# EAGLE design battleship (EAGLE 9.2.0)
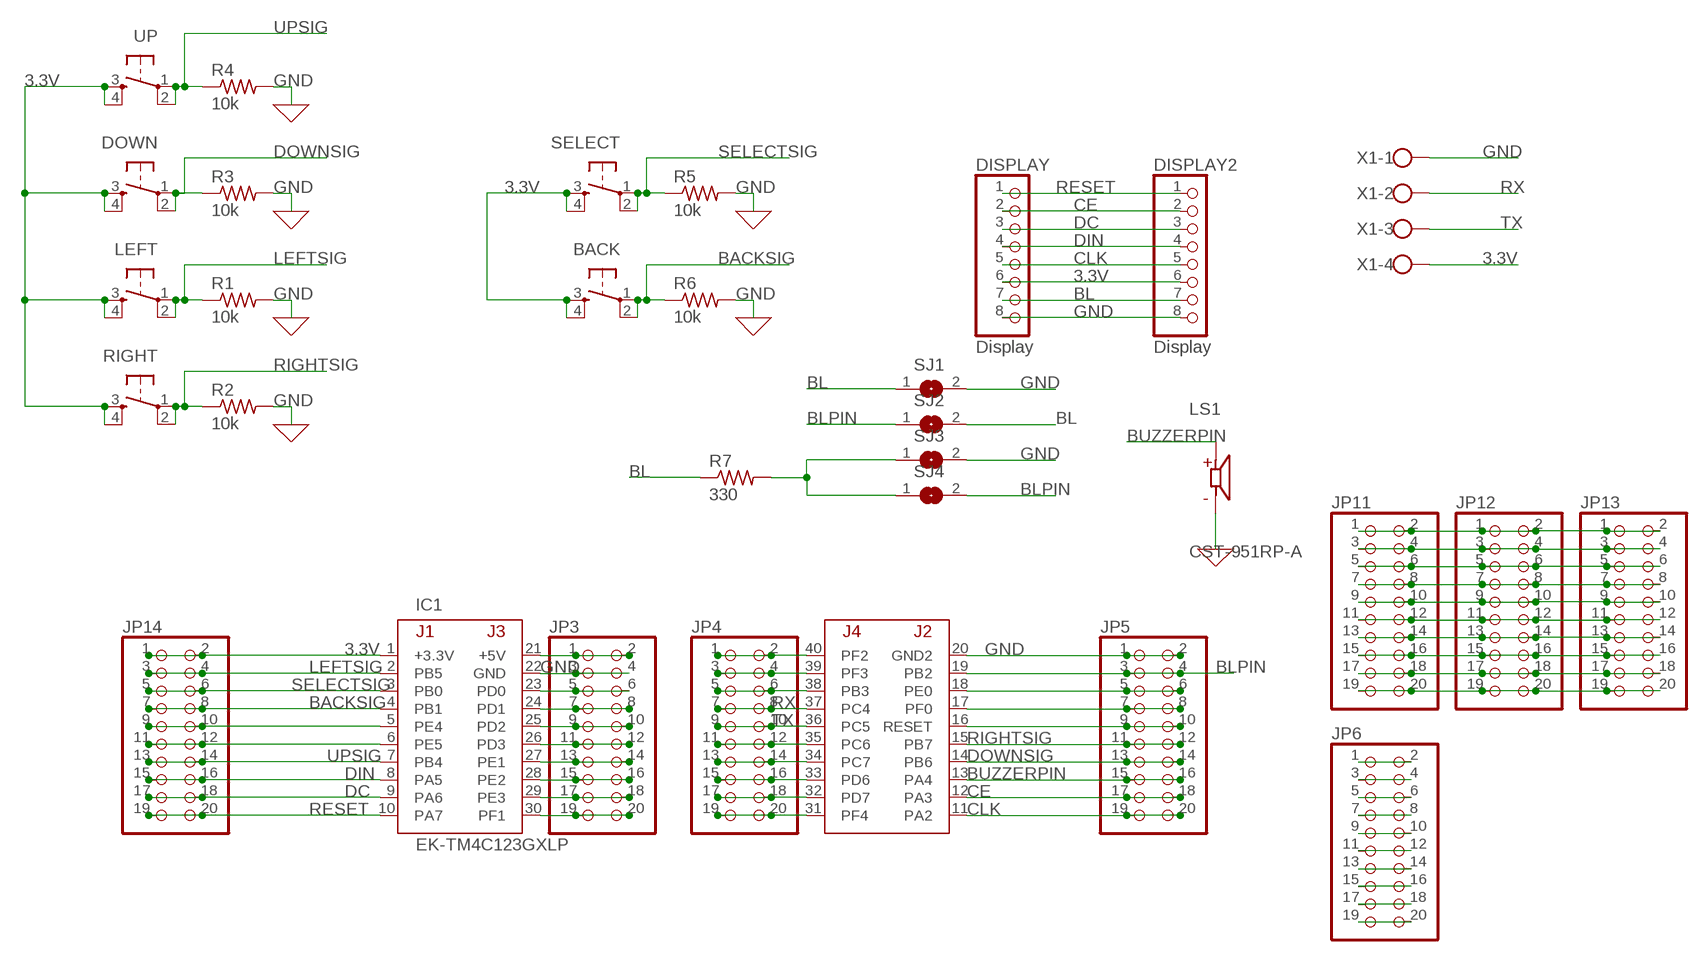
[diagram p0: schematic, sheet 1]

## Parts
BACK  TAC_SWITCHPTH  [TACTILE-PTH]
DISPLAY  Display  PINHD-1X8  [1X08]
DISPLAY2  Display  PINHD-1X8  [1X08]
DOWN  TAC_SWITCHPTH  [TACTILE-PTH]
IC1  EK-TM4C123GXLP  [TM4C123LAUNCHPAD]
JP3  PINHD-2X10  [2X10]
JP4  PINHD-2X10  [2X10]
JP5  PINHD-2X10  [2X10]
JP6  PINHD-2X10  [2X10]
JP11  PINHD-2X10  [2X10]
JP12  PINHD-2X10  [2X10]
JP13  PINHD-2X10  [2X10]
JP14  PINHD-2X10  [2X10]
LEFT  TAC_SWITCHPTH  [TACTILE-PTH]
LS1  CST-951RP-A  [CUI_CST-951RP-A]
R1  10k  R-US_0207/10  [0207/10]
R2  10k  R-US_0207/10  [0207/10]
R3  10k  R-US_0207/10  [0207/10]
R4  10k  R-US_0207/10  [0207/10]
R5  10k  R-US_0207/10  [0207/10]
R6  10k  R-US_0207/10  [0207/10]
R7  330  R-US_0207/10  [0207/10]
RIGHT  TAC_SWITCHPTH  [TACTILE-PTH]
SELECT  TAC_SWITCHPTH  [TACTILE-PTH]
SJ1  SJ  [SJ]
SJ2  SJ  [SJ]
SJ3  SJ  [SJ]
SJ4  SJ  [SJ]
UP  TAC_SWITCHPTH  [TACTILE-PTH]
X1  W237-4  [W237-4]

## Nets
3.3V [power]: BACK.3 BACK.4 DISPLAY2.6 DISPLAY.6 DOWN.3 DOWN.4 IC1.1(+3.3V) JP14.1 JP14.2 LEFT.3 LEFT.4 RIGHT.3 RIGHT.4 SELECT.3 SELECT.4 UP.3 UP.4 X1.4
BACKSIG: BACK.1 BACK.2 IC1.4(PB1) JP14.7 JP14.8 R6.1
BL [power]: DISPLAY2.7 DISPLAY.7 R7.1 SJ1.1 SJ2.2
BLPIN [power]: IC1.19(PB2) JP5.3 JP5.4 SJ2.1 SJ4.2
BUZZERPIN: IC1.13(PA4) JP5.15 JP5.16 LS1.P
CE: DISPLAY2.2 DISPLAY.2 IC1.12(PA3) JP5.17 JP5.18
CLK: DISPLAY2.5 DISPLAY.5 IC1.11(PA2) JP5.19 JP5.20
DC: DISPLAY2.3 DISPLAY.3 IC1.9(PA6) JP14.17 JP14.18
DIN: DISPLAY2.4 DISPLAY.4 IC1.8(PA5) JP14.15 JP14.16
DOWNSIG: DOWN.1 DOWN.2 IC1.14(PB6) JP5.13 JP5.14 R3.1
GND [power]: DISPLAY2.8 DISPLAY.8 IC1.20(GND2) IC1.22(GND) JP3.3 JP3.4 JP5.1 JP5.2 LS1.M R1.2 R2.2 R3.2 R4.2 R5.2 R6.2 SJ1.2 SJ3.2 X1.1
LEFTSIG: IC1.2(PB5) JP14.3 JP14.4 LEFT.1 LEFT.2 R1.1
N$1: JP6.1 JP6.2
N$2: JP6.3 JP6.4
N$3: JP6.5 JP6.6
N$4: JP6.7 JP6.8
N$5: JP6.9 JP6.10
N$6 [power]: R7.2 SJ3.1 SJ4.1
N$7: JP6.11 JP6.12
N$8: JP6.13 JP6.14
N$9: JP6.15 JP6.16
N$10: JP6.19 JP6.20
N$11: JP6.17 JP6.18
N$17: IC1.5(PE4) JP14.9 JP14.10
N$21: IC1.21(+5V) JP3.1 JP3.2
N$23: IC1.23(PD0) JP3.5 JP3.6
N$24: IC1.24(PD1) JP3.7 JP3.8
N$31: IC1.16(RESET) JP5.9 JP5.10
N$32: IC1.17(PF0) JP5.7 JP5.8
N$33: IC1.18(PE0) JP5.5 JP5.6
N$36: IC1.28(PE2) JP3.15 JP3.16
N$37: IC1.29(PE3) JP3.17 JP3.18
N$38: IC1.30(PF1) JP3.19 JP3.20
N$39: IC1.31(PF4) JP4.19 JP4.20
N$40: IC1.32(PD7) JP4.17 JP4.18
N$41: IC1.26(PD3) JP3.11 JP3.12
N$42: IC1.25(PD2) JP3.9 JP3.10
N$52: JP11.3 JP11.4 JP12.3 JP12.4 JP13.3 JP13.4
N$55: JP11.7 JP11.8 JP12.7 JP12.8 JP13.7 JP13.8
N$56: IC1.33(PD6) JP4.15 JP4.16
N$57: IC1.34(PC7) JP4.13 JP4.14
N$58: JP11.11 JP11.12 JP12.11 JP12.12 JP13.11 JP13.12
N$59: IC1.35(PC6) JP4.11 JP4.12
N$60: JP11.15 JP11.16 JP12.15 JP12.16 JP13.15 JP13.16
N$61: JP11.17 JP11.18 JP12.17 JP12.18 JP13.17 JP13.18
N$62: JP11.19 JP11.20 JP12.19 JP12.20 JP13.19 JP13.20
N$65: IC1.38(PB3) JP4.5 JP4.6
N$66: IC1.39(PF3) JP4.3 JP4.4
N$67: IC1.40(PF2) JP4.1 JP4.2
N$68: IC1.6(PE5) JP14.11 JP14.12
N$69: IC1.27(PE1) JP3.13 JP3.14
N$73: JP11.1 JP11.2 JP12.1 JP12.2 JP13.1 JP13.2
N$76: JP11.5 JP11.6 JP12.5 JP12.6 JP13.5 JP13.6
N$77: JP11.9 JP11.10 JP12.9 JP12.10 JP13.9 JP13.10
N$79: JP11.13 JP11.14 JP12.13 JP12.14 JP13.13 JP13.14
RESET: DISPLAY2.1 DISPLAY.1 IC1.10(PA7) JP14.19 JP14.20
RIGHTSIG: IC1.15(PB7) JP5.11 JP5.12 R2.1 RIGHT.1 RIGHT.2
RX: IC1.37(PC4) JP4.7 JP4.8 X1.2
SELECTSIG: IC1.3(PB0) JP14.5 JP14.6 R5.1 SELECT.1 SELECT.2
TX: IC1.36(PC5) JP4.9 JP4.10 X1.3
UPSIG: IC1.7(PB4) JP14.13 JP14.14 R4.1 UP.1 UP.2

## Library data of the parts
BACK DOWN LEFT RIGHT SELECT UP = SparkFun:TAC_SWITCH: Momentary Switch Button commonly used for reset or general input. Spark Fun Electronics SKU : COM-00097
DISPLAY DISPLAY2 = pinhead:PINHD-1X8: PIN HEADER
IC1 = EE445L:EK-TM4C123GXL: Texas Instruments TM4C123 LaunchPad EK-TM4C123GXL www.ti.com/tool/ek-tm4c123gxl
JP3-JP6 JP11-JP14 = pinhead:PINHD-2X10: PIN HEADER
LS1 = CST-951RP-A:CST-951RP-A: 9 mm, 5 V, 85 dB, Through Hole, Side Port, Magnetic Audio Transducer Buzzer; AVAILABILITY: Unavailable; CUI_PURCHASE_URL: https://www.cui.com/product/audio/buzzers/audio-transducers/magnetic/cst-951rp-a?utm_source=snapeda.com&utm_medium=referral&utm_campaign=snapedaBOM; DESCRIPTION: 9 mm, 5 V, 85 dB, Through Hole, Side Port, Magnetic Audio Transducer Buzzer; MF: CUI Inc.; MP: CST-951RP-A; PACKAGE: CUI; PRICE: None
R1-R7 = rcl:R-US_: RESISTOR, American symbol; SPICEPREFIX: R
SJ1-SJ4 = jumper:SJ: SMD solder JUMPER
X1 = con-wago-500:W237-4: WAGO SCREW CLAMP; OC_FARNELL: unknown; OC_NEWARK: unknown

## Net classes
0 default: width 0.406 mm, drill 0.406 mm
1 power: width 1.27 mm

## Board
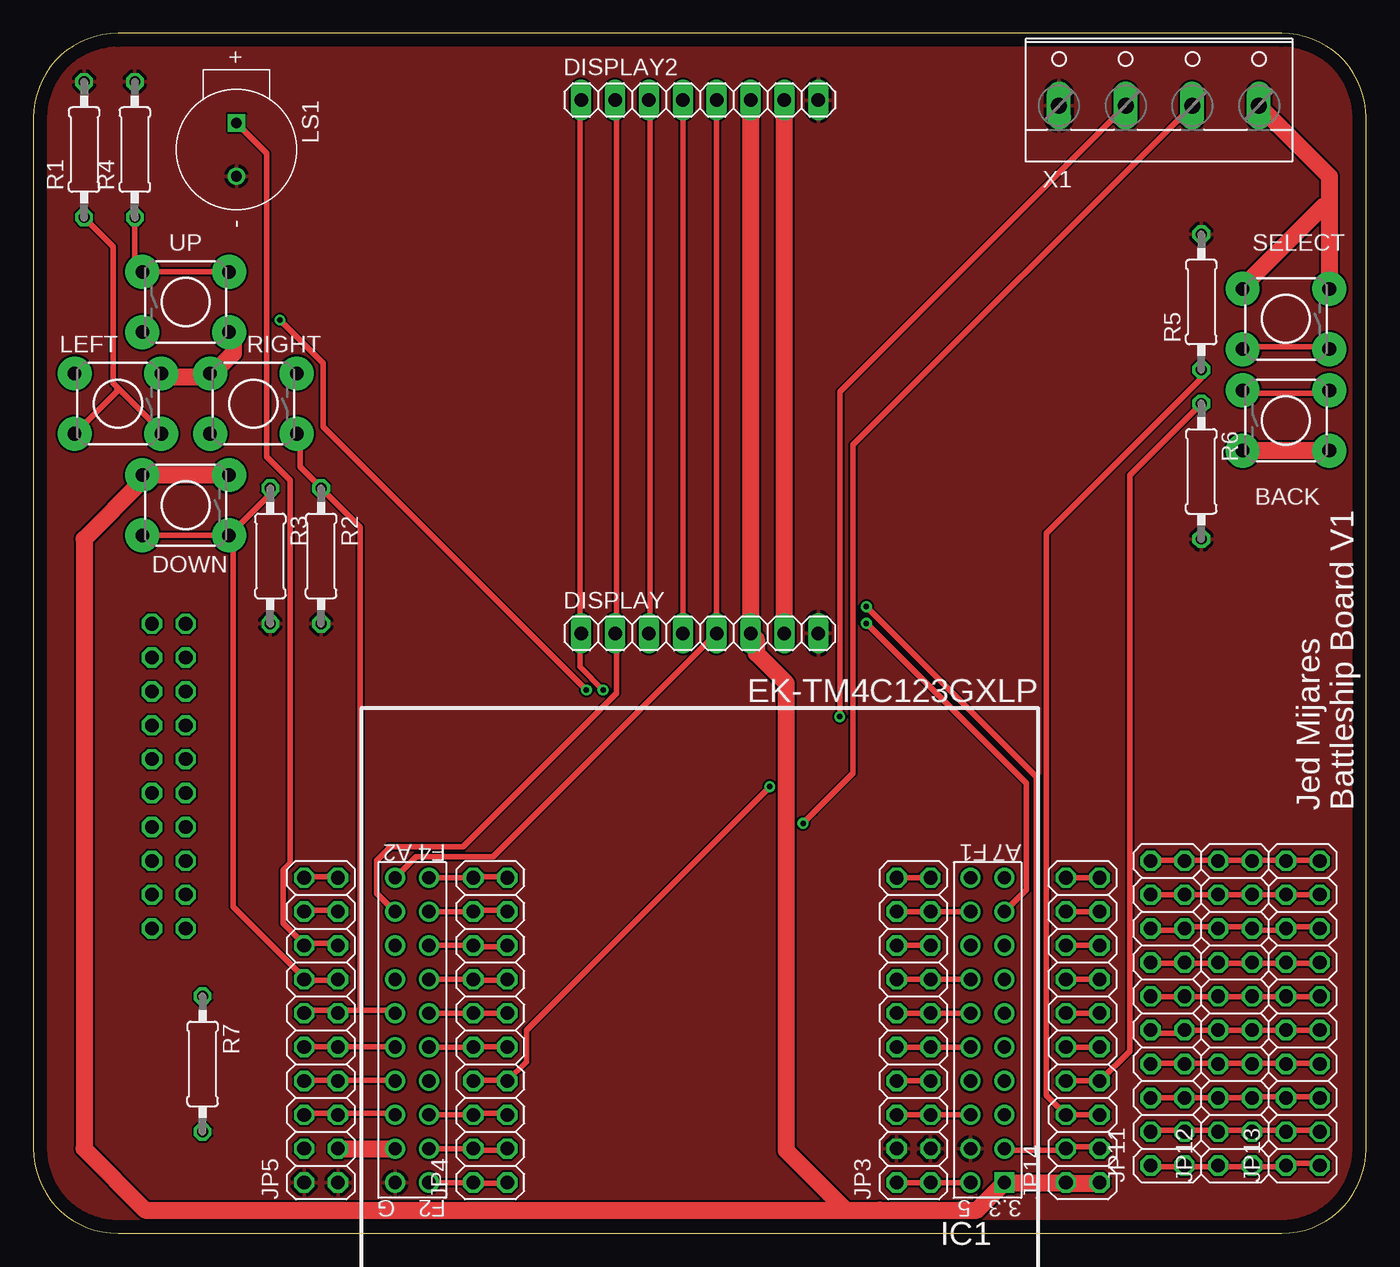
[diagram p1: board, top side]
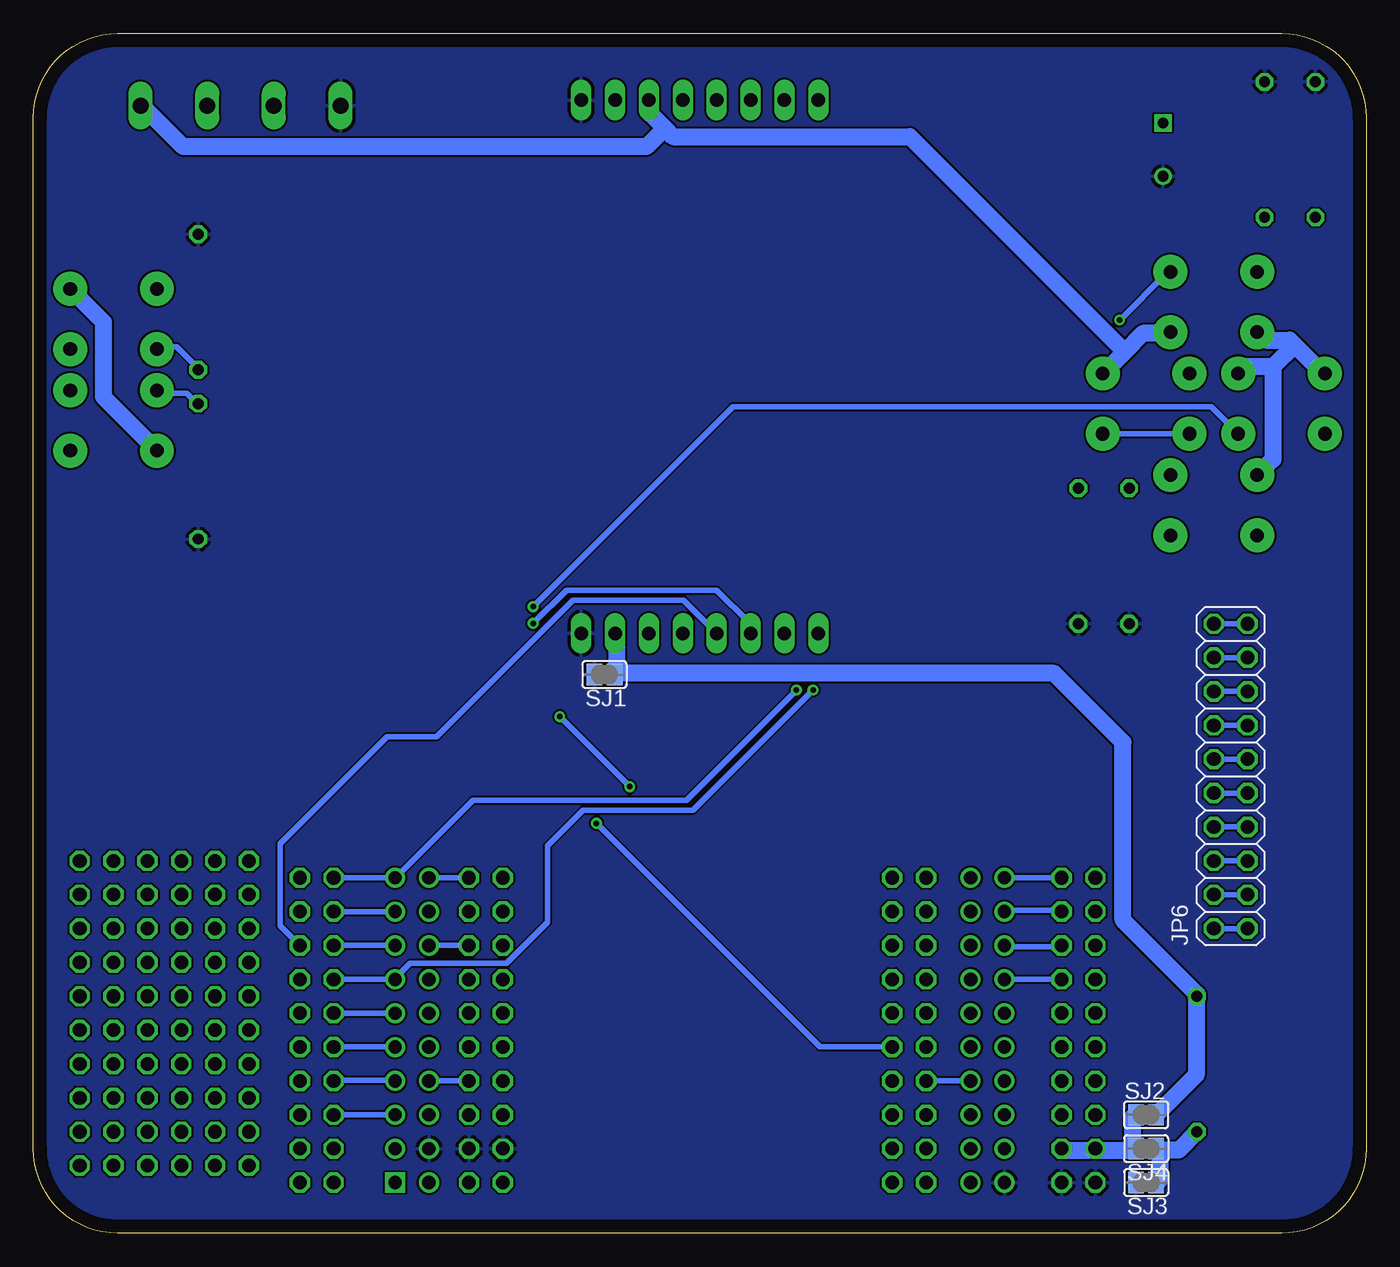
[diagram p2: board, bottom side, seen from below]

Size 100 x 90 mm. Coordinates in mm from the lower left corner, seen from the top.
Outline: 100,6.35 100,83.65 arc90 93.65,90 6.35,90 arc90 0,83.65 0,6.35 arc90 6.35,0 93.65,0 arc90 100,6.35
Copper layers (1*16): Top 0.035mm / dielectric 1.5mm / Bottom 0.035mm
Design rules "default": minimum track width 6mil, minimum drill 0.35mm, track to track 6mil, track to pad 6mil, pad to pad 6mil, via to via 6mil, smd to smd 6mil, copper to edge 40mil, drill to drill 6mil, minimum pad ring 10mil, minimum via ring 8mil, stop-mask expansion 4mil, vias tented up to drill 0mil, thermal gap 10mil

### Footprints (pad centres in the part's own frame; a part is rotated, then mirrored left to right if it is on the bottom)
TACTILE-PTH = drill 1.016 pad 2.54: 1 -3.251,2.261; 2 3.251,2.261; 3 -3.251,-2.261; 4 3.251,-2.261
1X08 = drill 1.016 long: 1 -8.89,0; 2 -6.35,0; 3 -3.81,0; 4 -1.27,0; 5 1.27,0; 6 3.81,0; 7 6.35,0; 8 8.89,0
TM4C123LAUNCHPAD = drill 1 square: 1 -22.86,12.7 | drill 1: 2 -22.86,10.16; 3 -22.86,7.62; 4 -22.86,5.08; 5 -22.86,2.54; 6 -22.86,0; 7 -22.86,-2.54; 8 -22.86,-5.08; 9 -22.86,-7.62; 10 -22.86,-10.16; 11 22.86,-10.16; 12 22.86,-7.62; 13 22.86,-5.08; 14 22.86,-2.54; 15 22.86,0; 16 22.86,2.54; 17 22.86,5.08; 18 22.86,7.62; 19 22.86,10.16; 20 22.86,12.7; 21 -20.32,12.7; 22 -20.32,10.16; 23 -20.32,7.62; 24 -20.32,5.08; 25 -20.32,2.54; 26 -20.32,0; 27 -20.32,-2.54; 28 -20.32,-5.08; 29 -20.32,-7.62; 30 -20.32,-10.16; 31 20.32,-10.16; 32 20.32,-7.62; 33 20.32,-5.08; 34 20.32,-2.54; 35 20.32,0; 36 20.32,2.54; 37 20.32,5.08; 38 20.32,7.62; 39 20.32,10.16; 40 20.32,12.7
2X10 = drill 1.016 octagon: 1 -11.43,-1.27; 2 -11.43,1.27; 3 -8.89,-1.27; 4 -8.89,1.27; 5 -6.35,-1.27; 6 -6.35,1.27; 7 -3.81,-1.27; 8 -3.81,1.27; 9 -1.27,-1.27; 10 -1.27,1.27; 11 1.27,-1.27; 12 1.27,1.27; 13 3.81,-1.27; 14 3.81,1.27; 15 6.35,-1.27; 16 6.35,1.27; 17 8.89,-1.27; 18 8.89,1.27; 19 11.43,-1.27; 20 11.43,1.27
CUI_CST-951RP-A = drill 0.8: M 2,0 | drill 0.8 square: P -2,0
0207/10 = drill 0.813 octagon: 1 -5.08,0; 2 5.08,0
SJ = smd 1.168 x 1.6: 1 -0.762,0; 2 0.762,0
W237-4 = drill 1.194 long: 1 -7.5,-1.27; 2 -2.5,-1.27; 3 2.5,-1.27; 4 7.5,-1.27

### Placement (x,y rotation side)
BACK  93.98,60.96 0 top
DISPLAY  50,45 0 top
DISPLAY2  50,85 0 top
DOWN  11.43,54.61 180 top
IC1  50,16.51 180 top
JP3  66.04,15.24 90 top
JP4  34.29,15.24 90 top
JP5  21.59,15.24 90 top
JP6  10.16,34.29 90 bottom
JP11  85.09,16.51 90 top
JP12  90.17,16.51 90 top
JP13  95.25,16.51 90 top
JP14  78.74,15.24 90 top
LEFT  6.35,62.23 180 top
LS1  15.24,81.28 270 top
R1  3.81,81.28 90 top
R2  21.59,50.8 270 top
R3  17.78,50.8 270 top
R4  7.62,81.28 90 top
R5  87.63,69.85 90 top
R6  87.63,57.15 270 top
R7  12.7,12.7 270 top
RIGHT  16.51,62.23 180 top
SELECT  93.98,68.58 180 top
SJ1  57.15,41.91 180 bottom
SJ2  16.51,8.89 0 bottom
SJ3  16.51,3.81 180 bottom
SJ4  16.51,6.35 180 bottom
UP  11.43,69.85 0 top
X1  84.45,85.85 0 top

### Tracks (layer width: path | path; a pad name or v marks a point on that pad's centre or on a via)
3.3V
  Top 1.27: 97.25,77 97.25,79.25 92,84.5 X1.4 | SELECT.4 90.75,71 96.75,77 97.25,77 | UP.4 14.75,67.5 14.75,67 15,66.75 15,66 13.5,64.5 RIGHT.4 12.75,64.25 9.75,64.25 LEFT.3 | JP14.1 80,3.75 78,3.75 JP14.2 77.25,3.75 73,3.75 IC1.1 70.8,1.75 63.5,1.75 60.96,1.75 | BACK.4 BACK.3 | SELECT.3 97.25,70.86 97.25,77 | DISPLAY2.6 DISPLAY.6 54.25,44.56 54.25,43.5 56.5,41.25 56.5,6.21 60.96,1.75 | DOWN.3 DOWN.4 8.18,56.44 3.81,52.07 3.81,6.35 8.41,1.75 60.96,1.75
  Bottom 1.27: 18.12,66.12 16.75,67.5 14.75,67.5 UP.4 | 18.12,66.12 RIGHT.3 | 5.38,66.62 5.75,67 7.5,67 8,67.5 UP.3 | 5.38,66.62 3.25,64.5 LEFT.4 | 7,65 9,65 9.5,64.5 LEFT.3 | 5.38,66.62 7,65 | 18.12,66.12 34.25,82.25 52,82.25 52.62,82.88 | 52.62,82.88 53.75,84 53.75,85 DISPLAY2.6 | 52.62,82.88 54,81.5 88.75,81.5 91.83,84.58 X1.4 | BACK.3 90.73,58.73 94.75,62.75 94.75,68.36 SELECT.3 | 7,65 7,58.05 DOWN.4
BACKSIG
  Top 0.406: BACK.2 97,63 90.75,63 BACK.1 | R6.1 82.25,56.85 82.25,13.67 JP14.7 JP14.8
  Bottom 0.406: IC1.4 73,11.5 77.25,11.5 JP14.8 | R6.1 87.75,62.25 88.5,63 90.5,63 BACK.1
BL
  Top 1.27: DISPLAY.7 DISPLAY2.7
  Bottom 1.27: 56.25,42 56.25,45 DISPLAY.7 | 56.25,42 SJ1.1 | SJ2.2 12.75,11.89 12.75,17.73 R7.1 12.7,17.95 18.25,23.5 18.25,36.83 23.42,42 56.25,42
BLPIN
  Top 1.27: JP5.3 IC1.19
  Bottom 1.27: SJ2.1 17.5,8.75 17.5,6.75 SJ4.2 17.5,6.25 20.25,6.25 JP5.4 20.75,6.25 22.75,6.25 JP5.3
BUZZERPIN
  Top 0.406: JP5.15 22.75,21.75 20.5,21.75 JP5.16 20.32,21.68 18.75,23.25 18.75,27.25 19.25,27.75 19.25,56.5 17.5,58.25 17.5,81 15.24,83.26 LS1.P
  Bottom 0.406: IC1.13 27,21.5 23,21.5 JP5.15
CE
  Top 0.406: JP5.18 20.5,24.25 22.75,24.25 JP5.17 | 43.75,45 43.75,40.5 32.25,29 26.67,29 26.67,28.86 25.75,27.94 25.75,25.52 IC1.12 | 43.75,45 43.75,85 DISPLAY2.2 | 43.75,45 DISPLAY.2
  Bottom 0.406: IC1.12 27,24.25 23,24.25 JP5.17
CLK
  Top 0.406: JP5.20 20.5,26.75 22.75,26.75 JP5.19 | 51.25,45 34.5,28.25 28.72,28.25 IC1.11 | 51.25,45 DISPLAY.5 | 51.25,45 51.25,84.98 DISPLAY2.5
  Bottom 0.406: JP5.19 IC1.11
DC  (via drill 0.41)
  Top 0.406: DISPLAY.3 46.25,45 46.25,85 DISPLAY2.3 | v62.5,45.75 74.5,33.75 74.5,25.77 IC1.9 | JP14.18 JP14.17
  Bottom 0.406: v62.5,45.75 60,48.25 48.75,48.25 46.25,45.75 46.25,45 DISPLAY.3 | JP14.18 IC1.9
DIN
  Top 0.406: DISPLAY2.4 DISPLAY.4 | JP14.16 JP14.15
  Bottom 0.406: JP14.16 IC1.8 | JP14.15 81.5,23.08 81.5,29.21 73.46,37.25 69.75,37.25 59.5,47.5 51.23,47.5 DISPLAY.4
DOWNSIG
  Top 0.406: JP5.13 22.75,19 20.5,19 JP5.14 20.32,19.18 15,24.5 15,52.03 DOWN.1 | DOWN.1 17.78,55.45 R3.1 | DOWN.1 DOWN.2
  Bottom 0.406: JP5.13 IC1.14
GND
  pour Top: -11.43,97.79 -11.43,-6.35 104.14,-6.35 104.14,97.79
  pour Bottom: 107.95,95.25 107.95,-8.89 -8.89,-8.89 -8.89,95.25
LEFTSIG  (via drill 0.41)
  Top 0.406: 75.25,6.25 77.25,6.25 JP14.4 77.5,6.5 80,6.5 JP14.3 | 75.25,6.25 73,6.25 IC1.2 | 6.38,63.38 9.5,60.25 9.5,60 LEFT.1 | 6.38,63.38 6,63.75 6,74 4,76 R1.1 | 6.38,63.38 6.25,63.25 6.25,63.12 LEFT.2 | 75.25,6.25 75.25,34.25 v62.5,47
  Bottom 0.406: v62.5,47 47.5,62 11.63,62 LEFT.1
N$1
  Bottom 0.406: JP6.1 JP6.2
N$2
  Bottom 0.406: JP6.3 JP6.4
N$3
  Bottom 0.406: JP6.5 JP6.6
N$4
  Bottom 0.406: JP6.7 JP6.8
N$5
  Bottom 0.406: JP6.9 JP6.10
N$6
  Bottom 1.27: 15.5,6.25 15.5,4 SJ3.1 | 15.5,6.25 SJ4.1 | R7.2 14.07,6.25 15.5,6.25
N$7
  Bottom 0.406: JP6.11 JP6.12
N$8
  Bottom 0.406: JP6.13 JP6.14
N$9
  Bottom 0.406: JP6.15 JP6.16
N$10
  Bottom 0.406: JP6.19 JP6.20
N$11
  Bottom 0.406: JP6.17 JP6.18
N$17
  Top 0.406: JP14.10 JP14.9
  Bottom 0.406: IC1.5 73,14 77.25,14 JP14.10
N$21
  Top 0.406: IC1.21 JP3.1 JP3.2
N$23
  Top 0.406: IC1.23 JP3.5 JP3.6
N$24
  Top 0.406: JP3.7 JP3.8
  Bottom 0.406: JP3.7 IC1.24
N$31
  Top 0.406: IC1.16 27,14 23,14 JP5.9 22.75,14 20.5,14 JP5.10
N$32
  Top 0.406: IC1.17 27,11.5 23,11.5 JP5.7 22.75,11.5 20.5,11.5 JP5.8
N$33
  Top 0.406: IC1.18 27,9 23,9 JP5.5 22.75,9 20.5,9 JP5.6
N$36
  Top 0.406: JP3.15 JP3.16
  Bottom 0.406: JP3.15 IC1.28
N$37
  Top 0.406: JP3.18 JP3.17 IC1.29
N$38
  Top 0.406: JP3.19 JP3.20
  Bottom 0.406: JP3.19 IC1.30
N$39
  Top 0.406: JP4.19 35.5,26.75 33.25,26.75 JP4.20 IC1.31
N$40
  Top 0.406: JP4.17 35.5,24.25 33.25,24.25 JP4.18 IC1.32
N$41
  Top 0.406: JP3.12 JP3.11 IC1.26
N$42
  Top 0.406: JP3.10 JP3.9 IC1.25
N$52
  Top 0.406: JP11.4 84,7.75 86.25,7.75 JP11.3 86.5,7.75 88.75,7.75 JP12.4 89,7.75 91.25,7.75 JP12.3 91.5,7.75 93.75,7.75 JP13.4 94,7.75 96.5,7.75 JP13.3
N$55
  Top 0.406: JP11.8 84,12.75 86.25,12.75 JP11.7 86.5,12.75 88.75,12.75 JP12.8 89,12.75 91.25,12.75 JP12.7 91.5,12.75 93.75,12.75 JP13.8 94,12.75 96.5,12.75 JP13.7
N$56
  Top 0.406: JP4.15 35.5,21.5 33.25,21.5 JP4.16 IC1.33
N$57
  Top 0.406: JP4.13 35.5,19 33.25,19 JP4.14 IC1.34
N$58
  Top 0.406: JP11.12 84,17.75 86.25,17.75 JP11.11 86.5,17.75 88.75,17.75 JP12.12 89,17.75 91.25,17.75 JP12.11 91.5,17.75 93.75,17.75 JP13.12 94,17.75 96.5,17.75 JP13.11
N$59
  Top 0.406: JP4.11 35.5,16.5 33.25,16.5 JP4.12 IC1.35
N$60
  Top 0.406: JP11.16 84,22.75 86.25,22.75 JP11.15 86.5,23 88.75,23 JP12.16 89,23 91.25,23 JP12.15 91.5,22.75 93.75,22.75 JP13.16 94,23 96.5,23 JP13.15
N$61
  Top 0.406: JP11.18 JP11.17 JP12.18 JP12.17 JP13.18 JP13.17
N$62
  Top 0.406: JP11.20 84,28 86.25,28 JP11.19 86.5,28 88.75,28 JP12.20 89,28 91.25,28 JP12.19 91.5,28 93.75,28 JP13.20 94,28 96.5,28 JP13.19
N$65
  Top 0.406: JP4.5 35.5,9 33.25,9 JP4.6 IC1.38
N$66
  Top 0.406: JP4.3 35.5,6.25 33.25,6.25 JP4.4 IC1.39
N$67
  Top 0.406: JP4.1 35.5,3.75 33.25,3.75 JP4.2 IC1.40
N$68
  Top 0.406: JP14.12 JP14.11
  Bottom 0.406: JP14.12 IC1.6
N$69
  Top 0.406: JP3.14 JP3.13 IC1.27
N$73
  Top 0.406: JP11.2 84,5 86.25,5 JP11.1 86.5,5 88.75,5 JP12.2 89,5 91.25,5 JP12.1 91.5,5 93.75,5 JP13.2 94,5.25 96.5,5.25 JP13.1
N$76
  Top 0.406: JP13.5 96.5,10.25 94,10.25 JP13.6 93.75,10.25 91.5,10.25 JP12.5 JP12.6 JP11.5 JP11.6
N$77
  Top 0.406: JP11.10 84,15 86.25,15 JP11.9 86.5,15.25 88.75,15.25 JP12.10 89,15.25 91.25,15.25 JP12.9 91.5,15.25 93.75,15.25 JP13.10 94,15.25 96.5,15.25 JP13.9
N$79
  Top 0.406: JP11.14 84,20.25 86.25,20.25 JP11.13 86.5,20.25 88.75,20.25 JP12.14 89,20.25 91.25,20.25 JP12.13 91.5,20.25 93.75,20.25 JP13.14 94,20.25 96.5,20.25 JP13.13
RESET  (via drill 0.41)
  Top 0.406: 41,45 41,85 DISPLAY2.1 | v42.75,40.75 41,42.5 41,45 | 41,45 DISPLAY.1 | JP14.20 JP14.19
  Bottom 0.406: v42.75,40.75 51,32.5 67,32.5 72.75,26.75 IC1.10 JP14.20
RIGHTSIG
  Top 0.406: 24.5,16.75 23,16.75 JP5.11 22.75,16.75 20.5,16.75 JP5.12 | 24.5,16.75 27,16.75 IC1.15 | RIGHT.1 20,59.75 20,57.5 21.5,56 R2.1 24.5,52.97 24.5,16.75
  Bottom 0.406: RIGHT.1 RIGHT.2
RX  (via drill 0.41)
  Top 0.406: JP4.8 33.25,11.5 35.5,11.5 JP4.7 37,12.87 37,15.25 v55.25,33.5 | v60.5,38.75 60.5,63.13 X1.2
  Bottom 0.406: v55.25,33.5 v60.5,38.75 | JP4.8 IC1.37
SELECTSIG
  Top 0.406: SELECT.1 97,66.5 90.75,66.5 SELECT.2 | R5.1 87.63,64.13 76,52.5 76,10.36 JP14.6 JP14.5
  Bottom 0.406: R5.1 87.75,65 89.25,66.5 90.5,66.5 SELECT.2 | JP14.6 IC1.3
TX  (via drill 0.41)
  Top 0.406: JP4.9 35.5,14 33.25,14 JP4.10 IC1.36 | v57.75,30.75 58.59,31.59 61.5,34.5 61.5,59.13 X1.3
  Bottom 0.406: v57.75,30.75 41,14 35.59,14 JP4.9
UPSIG  (via drill 0.41)
  Top 0.406: v41.5,40.75 21.75,60.5 21.75,65.25 v18.5,68.5 | R4.1 7.62,72.67 UP.1 UP.2 | JP14.14 JP14.13
  Bottom 0.406: v41.5,40.75 50.5,31.75 58.75,31.75 61.42,29.07 61.42,23.32 64.5,20.25 71.75,20.25 72.75,19.25 IC1.7 JP14.14 | v18.5,68.5 15,72 14.75,72 UP.2

### Text on the board
tPlace: Jed Mijares | Battleship Board V1